# EAGLE design circuitPendulum8TIA (EAGLE 6.6.0)
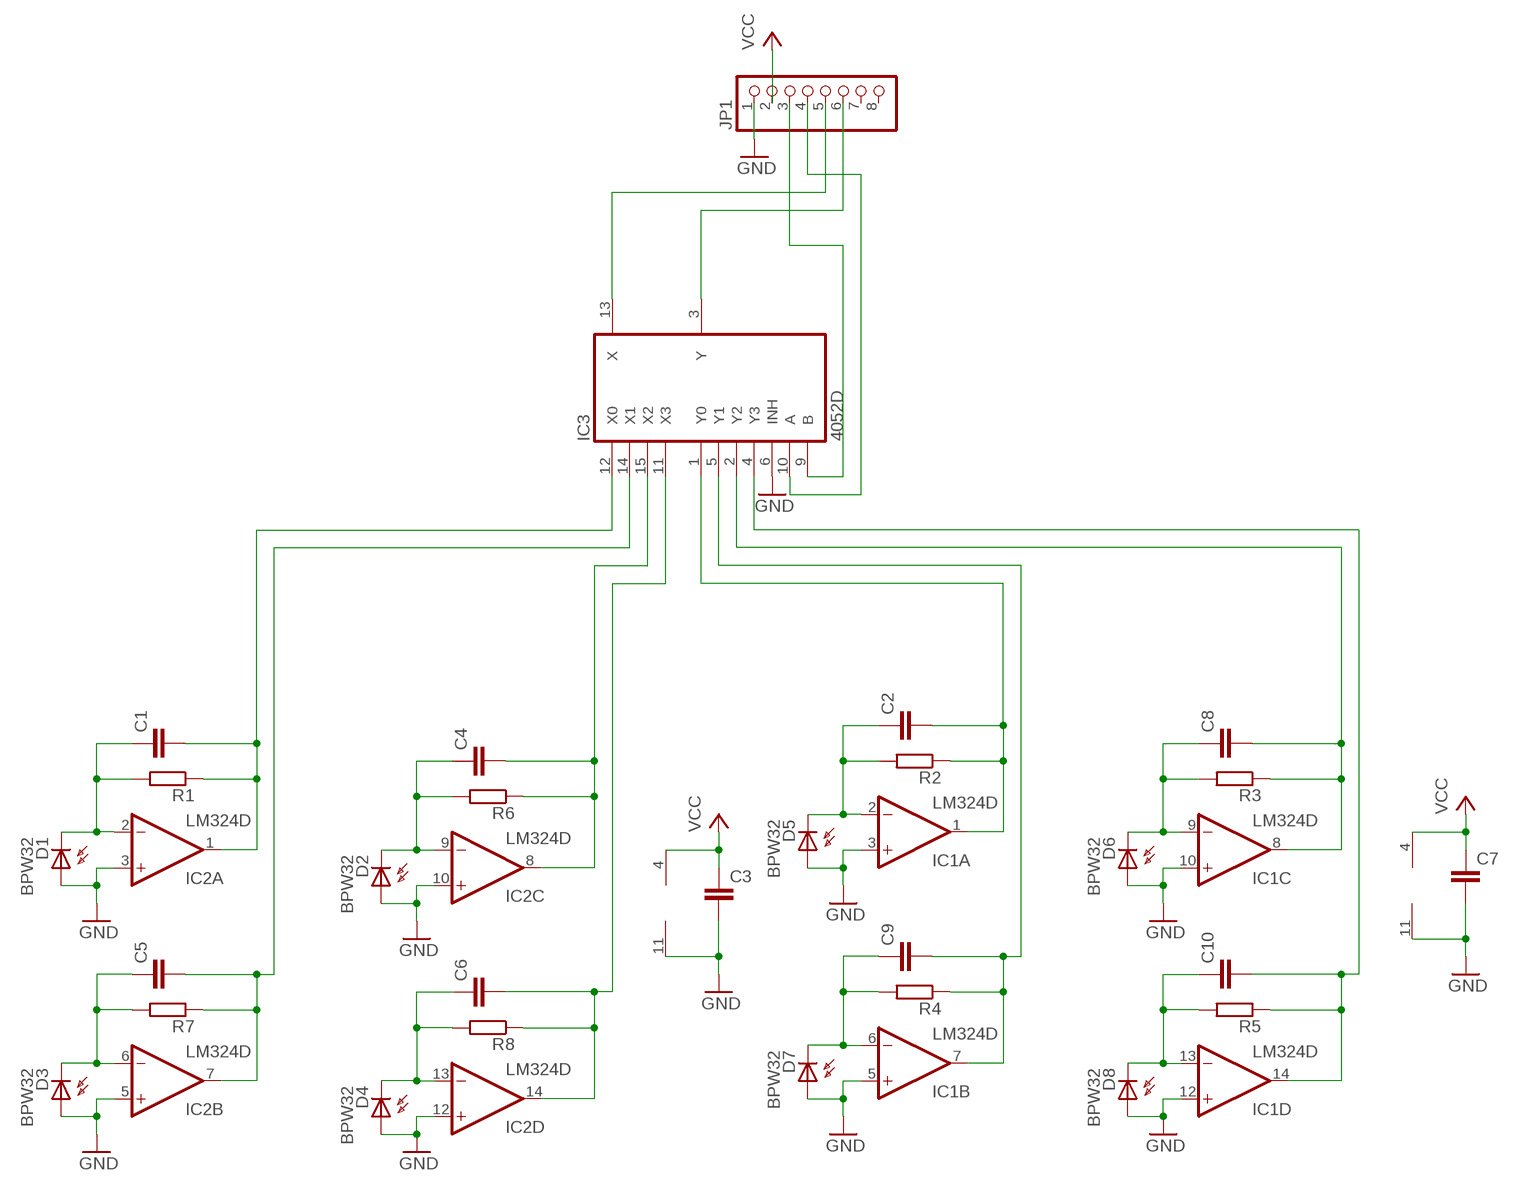
[diagram p0: schematic, sheet 1]

## Parts
C1  C-EUC0603  [C0603]
C2  C-EUC0603  [C0603]
C3  C-EUC0603  [C0603]
C4  C-EUC0603  [C0603]
C5  C-EUC0603  [C0603]
C6  C-EUC0603  [C0603]
C7  C-EUC0603  [C0603]
C8  C-EUC0603  [C0603]
C9  C-EUC0603  [C0603]
C10  C-EUC0603  [C0603]
D1  BPW32  [BPW32]
D2  BPW32  [BPW32]
D3  BPW32  [BPW32]
D4  BPW32  [BPW32]
D5  BPW32  [BPW32]
D6  BPW32  [BPW32]
D7  BPW32  [BPW32]
D8  BPW32  [BPW32]
IC1  LM324D  [SO14]
IC2  LM324D  [SO14]
IC3  4052D  [SO16]
JP1  PINHD-1X8_2.54  [1X08]
R1  R-EU_R0603  [R0603]
R2  R-EU_R0603  [R0603]
R3  R-EU_R0603  [R0603]
R4  R-EU_R0603  [R0603]
R5  R-EU_R0603  [R0603]
R6  R-EU_R0603  [R0603]
R7  R-EU_R0603  [R0603]
R8  R-EU_R0603  [R0603]

## Nets
GND: C3.2 C7.2 D1.A D2.A D3.A D4.A D5.A D6.A D7.A D8.A IC1.3(A:+IN) IC1.5(B:+IN) IC1.10(C:+IN) IC1.11(P:V-) IC1.12(D:+IN) IC2.3(A:+IN) IC2.5(B:+IN) IC2.10(C:+IN) IC2.11(P:V-) IC2.12(D:+IN) IC3.6(INH) JP1.1
N$1: C2.1 D5.K(C) IC1.2(A:-IN) R2.2
N$2: C2.2 IC1.1(A:OUT) IC3.1(Y0) R2.1
N$3: C8.2 IC1.8(C:OUT) IC3.2(Y2) R3.1
N$4: C9.1 D7.K(C) IC1.6(B:-IN) R4.2
N$5: C9.2 IC1.7(B:OUT) IC3.5(Y1) R4.1
N$6: C10.2 IC1.14(D:OUT) IC3.4(Y3) R5.1
N$7: C4.2 IC2.8(C:OUT) IC3.15(X2) R6.1
N$8: C1.1 D1.K(C) IC2.2(A:-IN) R1.2
N$9: C5.1 D3.K(C) IC2.6(B:-IN) R7.2
N$10: C5.2 IC2.7(B:OUT) IC3.14(X1) R7.1
N$11: C1.2 IC2.1(A:OUT) IC3.12(X0) R1.1
N$12: C6.2 IC2.14(D:OUT) IC3.11(X3) R8.1
N$13: C6.1 D4.K(C) IC2.13(D:-IN) R8.2
N$14: C4.1 D2.K(C) IC2.9(C:-IN) R6.2
N$15: C10.1 D8.K(C) IC1.13(D:-IN) R5.2
N$16: C8.1 D6.K(C) IC1.9(C:-IN) R3.2
N$17: IC3.13(X) JP1.5
N$18: IC3.3(Y) JP1.6
N$19: IC3.10(A) JP1.4
N$20: IC3.9(B) JP1.3
VCC: C3.1 C7.1 IC1.4(P:V+) IC2.4(P:V+) JP1.2
Unconnected: JP1.7 JP1.8

## Power pins joined to a net without a drawn wire
GND: IC3.8(GND)
VCC: IC3.16(VCC)
VEE: IC3.7(VEE)

## Library data of the parts
C1-C10 = resistor:C-EU: CAPACITOR, European symbol
D1-D8 = opto-trans-siemens:BPW32: PHOTO DIODE; OC_FARNELL: unknown; OC_NEWARK: unknown
IC1 IC2 = linear:LM324: OP AMP
IC3 = 40xx:4052: Dual 4-channel ANALOG MULTIPLEXER
JP1 = pinhead1:PINHD-1X8: PIN HEADER
R1-R8 = resistor:R-EU_: RESISTOR, European symbol

## Board
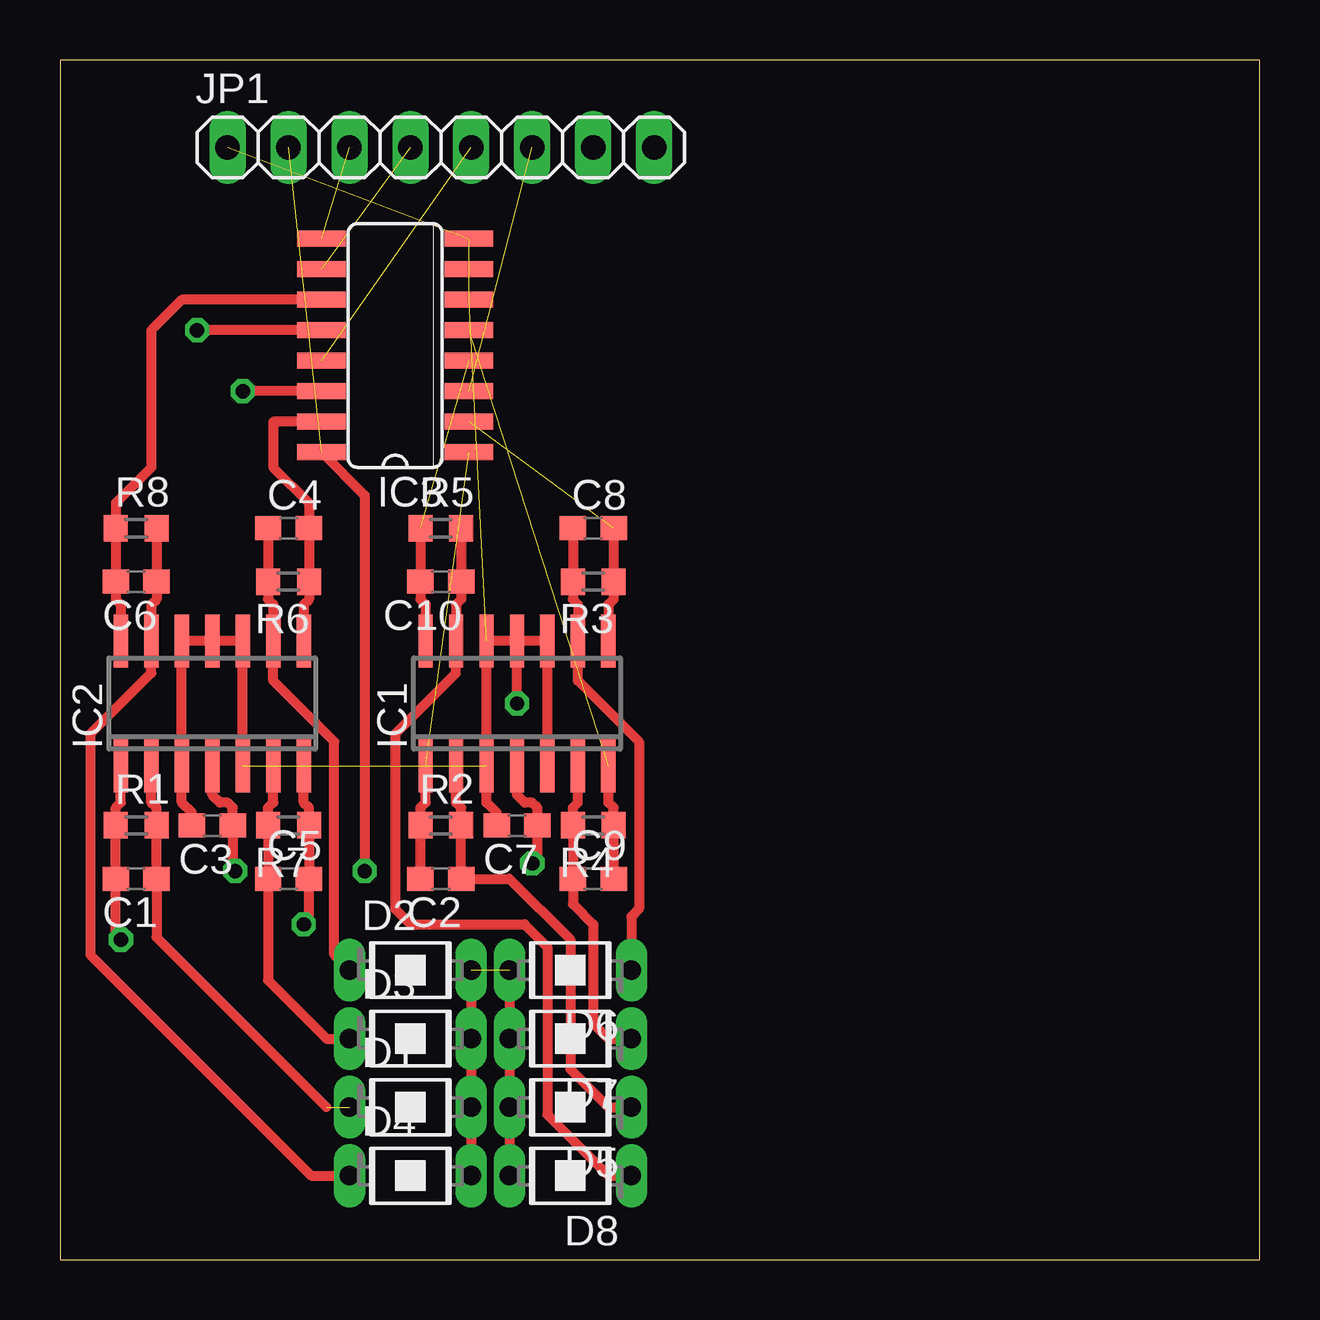
[diagram p1: board, top side]
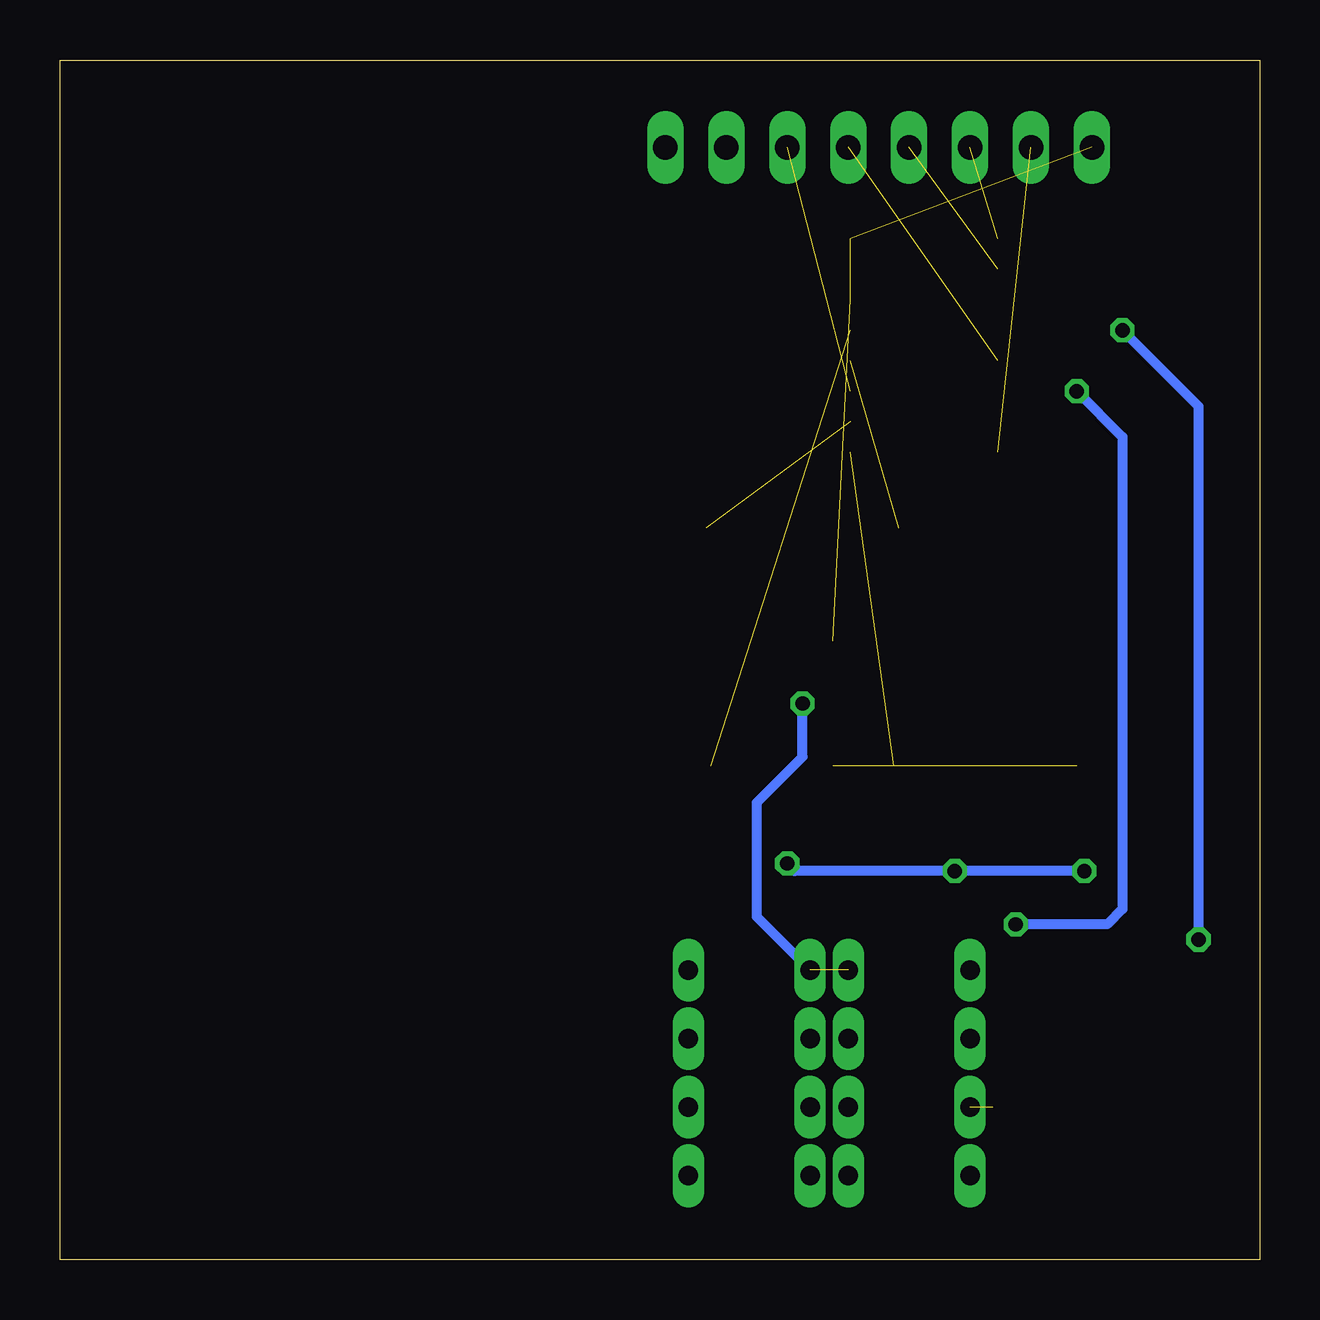
[diagram p2: board, bottom side, seen from below]

Size 50 x 50 mm. Coordinates in mm from the lower left corner, seen from the top.
Outline: 0,0 50,0 50,50 0,50 0,0
Copper layers (1*16): Top 0.035mm / dielectric 1.5mm / Bottom 0.035mm
Design rules "default": minimum track width 10mil, minimum drill 24mil, track to track 8mil, track to pad 8mil, pad to pad 8mil, via to via 8mil, smd to smd 8mil, copper to edge 40mil, drill to drill 8mil, minimum pad ring 10mil, minimum via ring 8mil, stop-mask expansion 4mil, vias tented up to drill 0mil, thermal gap 10mil

### Footprints (pad centres in the part's own frame; a part is rotated, then mirrored left to right if it is on the bottom)
C0603 = smd 1.1 x 1: 1 -0.85,0; 2 0.85,0
BPW32 = drill 0.813 long: A 0,2.54; K 0,-2.54
SO14 = smd 0.6 x 2.2: 1 -3.81,-2.6; 2 -2.54,-2.6; 3 -1.27,-2.6; 4 0,-2.6; 5 1.27,-2.6; 6 2.54,-2.6; 7 3.81,-2.6; 8 3.81,2.6; 9 2.54,2.6; 10 1.27,2.6; 11 0,2.6; 12 -1.27,2.6; 13 -2.54,2.6; 14 -3.81,2.6
SO16 = smd 0.66 x 2.032: 1 -4.445,-3.073; 2 -3.175,-3.073; 3 -1.905,-3.073; 4 -0.635,-3.073; 5 0.635,-3.073; 6 1.905,-3.073; 7 3.175,-3.073; 8 4.445,-3.073; 9 4.445,3.073; 10 3.175,3.073; 11 1.905,3.073; 12 0.635,3.073; 13 -0.635,3.073; 14 -1.905,3.073; 15 -3.175,3.073; 16 -4.445,3.073
1X08 = drill 1.016 long: 1 -8.89,0; 2 -6.35,0; 3 -3.81,0; 4 -1.27,0; 5 1.27,0; 6 3.81,0; 7 6.35,0; 8 8.89,0
R0603 = smd 1 x 1.1: 1 -0.85,0; 2 0.85,0

### Placement (x,y rotation side)
C1  3.17,15.88 180 top
C2  15.88,15.88 180 top
C3  6.35,18.1 180 top
C4  9.53,30.48 0 top
C5  9.53,15.88 0 top
C6  3.17,28.26 180 top
C7  19.05,18.1 180 top
C8  22.23,30.48 0 top
C9  22.23,15.88 0 top
C10  15.88,28.26 180 top
D1  14.61,6.35 270 top
D2  14.61,12.06 270 top
D3  14.61,9.21 270 top
D4  14.61,3.49 270 top
D5  21.27,6.35 90 top
D6  21.27,12.06 90 top
D7  21.27,9.21 90 top
D8  21.27,3.49 90 top
IC1  19.05,23.18 0 top
IC2  6.35,23.18 0 top
IC3  13.97,38.1 90 top
JP1  15.88,46.35 0 top
R1  3.17,18.1 0 top
R2  15.88,18.1 0 top
R3  22.23,28.26 180 top
R4  22.23,18.1 180 top
R5  15.88,30.48 0 top
R6  9.53,28.26 180 top
R7  9.53,18.1 180 top
R8  3.17,30.48 0 top

### Tracks (layer width: path | path; a pad name or v marks a point on that pad's centre or on a via)
GND  (via drill 0.6)  (5 unrouted)
  Top 0.406: C3.2 5.5,18.63 5.08,19.05 IC2.3 IC2.12 IC2.11 IC2.10 IC2.5 | C7.2 18.2,18.63 17.78,19.05 IC1.3 IC1.12 IC1.11 | IC1.5 IC1.10 IC1.11 | D2.A D3.A D1.A D4.A | D8.A D5.A D7.A D6.A | v19.05,23.18 IC1.11
  Bottom 0.406: D6.A 20.95,14.29 20.95,19.05 19.05,20.95 v19.05,23.18
N$1
  Top 0.406: IC1.2 16.51,19.05 16.73,18.84 R2.2 C2.1 18.73,15.88 21.27,13.34 21.27,7.94 22.86,6.35 D5.K
N$2  (1 unrouted)
  Top 0.406: C2.2 R2.1 15.03,18.84 15.24,19.05 IC1.1
N$3  (1 unrouted)
  Top 0.406: IC1.8 22.86,27.3 23.07,27.52 R3.1 C8.2
N$4
  Top 0.406: IC1.6 21.59,19.05 21.38,18.84 R4.2 C9.1 21.38,14.82 22.23,13.97 22.23,9.84 22.86,9.21 D7.K
N$5  (1 unrouted)
  Top 0.406: C9.2 R4.1 23.07,18.84 22.86,19.05 IC1.7
N$6  (1 unrouted)
  Top 0.406: R5.1 C10.2 15.03,27.52 15.24,27.3 IC1.14
N$7
  Top 0.406: IC2.8 10.16,27.3 10.38,27.52 R6.1 C4.2 10.38,31.54 8.89,33.02 8.89,34.92 IC3.15
N$8  (1 unrouted)
  Top 0.406: IC2.2 3.81,19.05 4.03,18.84 R1.2 C1.1 4.03,13.44 11.11,6.35
N$9
  Top 0.406: IC2.6 8.89,19.05 8.68,18.84 R7.2 C5.1 8.68,11.64 11.11,9.21 D3.K
N$10  (via drill 0.6)
  Top 0.406: IC2.7 10.16,19.05 10.38,18.84 R7.1 C5.2 10.38,14.19 v10.16,13.97 | IC3.14 v7.62,36.2
  Bottom 0.406: v7.62,36.2 5.71,34.29 5.71,14.61 6.35,13.97 v10.16,13.97
N$11  (via drill 0.6)
  Top 0.406: IC2.1 2.54,19.05 2.33,18.84 R1.1 C1.2 2.33,13.55 v2.54,13.34 | IC3.12 v5.71,38.73
  Bottom 0.406: v2.54,13.34 2.54,35.56 v5.71,38.73
N$12
  Top 0.406: IC2.14 2.54,27.3 2.33,27.52 C6.2 R8.1 2.33,31.54 3.81,33.02 3.81,38.73 5.08,40.01 IC3.11
N$13
  Top 0.406: R8.2 C6.1 4.03,27.52 3.81,27.3 IC2.13 3.81,24.45 1.27,21.91 1.27,12.7 10.48,3.49 D4.K
N$14
  Top 0.406: C4.1 R6.2 8.68,27.52 8.89,27.3 IC2.9 8.89,24.13 11.43,21.59 11.43,12.7 D2.K
N$15
  Top 0.406: R5.2 C10.1 16.73,27.52 16.51,27.3 IC1.13 16.51,24.45 13.97,21.91 13.97,14.61 14.61,13.97 19.37,13.97 20.32,13.02 20.32,6.03 22.86,3.49 D8.K
N$16
  Top 0.406: C8.1 R3.2 21.38,27.52 21.59,27.3 IC1.9 21.59,24.13 24.13,21.59 24.13,14.61 23.81,14.29 D6.K
N$17  (1 unrouted)
N$18  (1 unrouted)
N$19  (1 unrouted)
N$20  (1 unrouted)
VCC  (via drill 0.6)  (1 unrouted)
  Top 0.406: IC2.4 6.35,19.37 6.67,19.05 6.99,19.05 7.2,18.84 C3.1 7.2,16.3 v7.3,16.19 | IC1.4 19.05,19.37 19.37,19.05 19.68,19.05 19.9,18.84 C7.1 19.9,16.73 v19.68,16.51 | IC3.16 12.7,31.85 v12.7,16.19
  Bottom 0.406: v7.3,16.19 v12.7,16.19 19.37,16.19 v19.68,16.51